# Altium schematic sheet Microcontroller.SchDoc
size A; DocumentNumber: 2; SheetNumber: 2; SheetTotal: 5
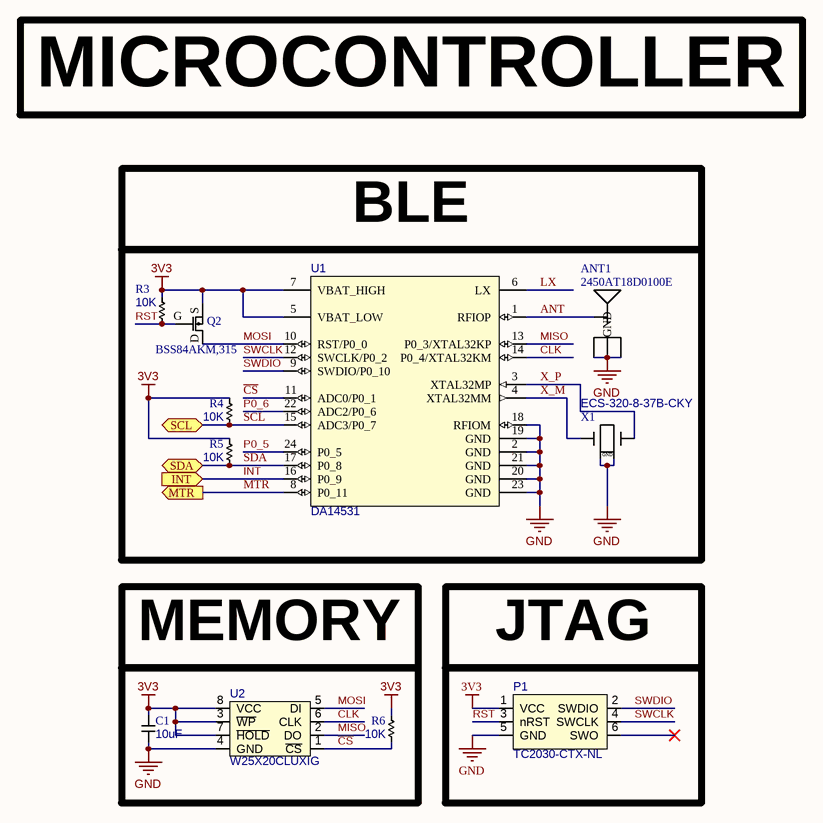
[diagram p0: Microcontroller.SchDoc]

## Parts
ANT1  2450AT18D0100E  [2450AT18D0100E_RH]
C1  10uF  [CAP_0402_HIGH]
P1  TC2030-CTX-NL  [TC2030-CTX-NL]
Q2  BSS84AKM,315  [BSS84AKM,315]
R3  10K  [RES_0402_HIGH]
R4  10K  [RES_0402_HIGH]
R5  10K  [RES_0402_HIGH]
R6  10K  [RES_0402_HIGH]
U1  DA14531  [DA14531 QFN]
U2  W25X20CLUXIG  [W25X20CLUXIG]
X1  ECS-320-8-37B-CKY  [ECS-320-8-37B-CKY]

## Ports
INT, MTR (out), SCL (bidir), SDA (bidir)

## Nets
3V3: C1.2 P1.1(VCC) Q2.S R3.2 R4.2 R5.2 R6.2 U1.5(VBAT_LOW) U1.7(VBAT_HIGH) U2.3(~{WP}) U2.7(~{HOLD}) U2.8(VCC)
GND: ANT1.2(GND) ANT1.3(GND) ANT1.4(GND) C1.1 P1.5(GND) U1.2(GND) U1.18(RFIOM) U1.19(GND) U1.20(GND) U1.21(GND) U1.23(GND) U2.4(GND) X1.2 X1.4(GND)
ANT: ANT1.1(FEED) U1.1(RFIOP)
~{CS}: R6.1 U1.11(ADC0/P0_1) U2.1(~{CS})
CLK: U1.14(P0_4/XTAL32KM) U2.6(CLK)
INT: U1.16(P0_9) ; port INT
LX: U1.6(LX)
MISO: U1.13(P0_3/XTAL32KP) U2.2(DO)
MOSI: Q2.D U1.10(RST/P0_0) U2.5(DI)
MTR: U1.8(P0_11) ; port MTR
P0_5: U1.24(P0_5)
P0_6: U1.22(ADC2/P0_6)
RST: P1.3(nRST) Q2.G R3.1
SCL: R4.1 U1.15(ADC3/P0_7) ; port SCL
SDA: R5.1 U1.17(P0_8) ; port SDA
SWCLK: P1.4(SWCLK) U1.12(SWCLK/P0_2)
SWDIO: P1.2(SWDIO) U1.9(SWDIO/P0_10)
X_M: U1.4(XTAL32MM) X1.1
X_P: U1.3(XTAL32MP) X1.3

Not connected (* = marked no-connect by the designer): P1 6(SWO)*

## Notes on the sheet
- MICROCONTROLLER
- BLE
- MEMORY
- (near P1) JTAG

## Library data of the parts
ANT1 = 2450AT18D0100E_RH: 2450AT18D0100E 2.4GHz  Chip RF Antenna 2.4GHz ~ 2.5GHz 1.5dBi Solder Surface Mount
C1 = Capacitor_0402: 0402 Capacitor
P1 = TC2030-CTX-NL: TC2030-CTX-NL Tag Connect Cable; ComponentLink1Description: Datasheet; ComponentLink1URL: https://www.tag-connect.com/wp-content/uploads/bsk-pdf-manager/TC2030-CTX_1.pdf
Q2 = BSS84AKM,315: BSS84AKM,315 MOSFET P-CH 50V SOT883
R3-R6 = Resistor_0402: 0402 Resistor
U1 = DA14531 QFN: DA14531 IC RF TxRx + MCU Bluetooth Bluetooth v5.1 2.4GHz 24-WFQFN, FC
U2 = W25X20CLUXIG: W25X20CLUXIG FLASH Memory IC 2Mb (256K x 8) SPI 104MHz  8-USON (2x3)
X1 = ECS-320-8-37B-CKY: ECS-320-8-37B-CKY CRYSTAL 32.0000MHZ 8PF SMD